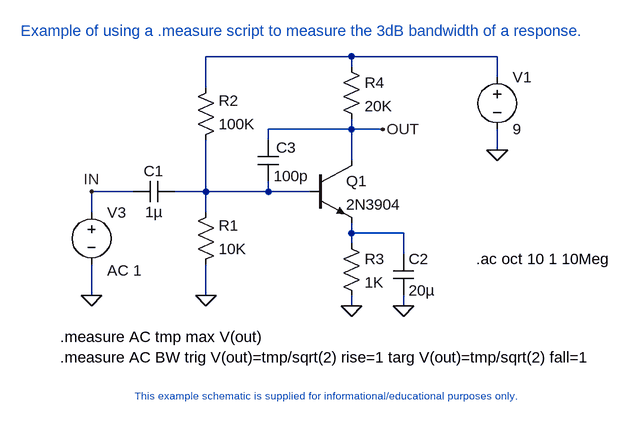
[diagram p0: schematic BW.asc]
BW.asc, the LTspice schematic file:
Version 4
SHEET 1 2344 1936
WIRE 400 1152 176 1152
WIRE 624 1152 400 1152
WIRE 400 1168 400 1152
WIRE 624 1184 624 1152
WIRE 176 1200 176 1152
WIRE 400 1264 400 1248
WIRE 400 1264 272 1264
WIRE 448 1264 400 1264
WIRE 272 1280 272 1264
WIRE 624 1296 624 1264
WIRE 400 1312 400 1264
WIRE 64 1360 0 1360
WIRE 176 1360 176 1280
WIRE 176 1360 128 1360
WIRE 272 1360 272 1344
WIRE 272 1360 176 1360
WIRE 336 1360 272 1360
WIRE 0 1392 0 1360
WIRE 176 1392 176 1360
WIRE 400 1424 400 1408
WIRE 480 1424 400 1424
WIRE 400 1440 400 1424
WIRE 480 1456 480 1424
WIRE 0 1520 0 1472
WIRE 176 1520 176 1472
WIRE 400 1536 400 1520
WIRE 480 1536 480 1520
FLAG 0 1520 0
FLAG 0 1360 IN
FLAG 176 1520 0
FLAG 400 1536 0
FLAG 448 1264 OUT
FLAG 624 1296 0
FLAG 480 1536 0
SYMBOL npn 336 1312 R0
SYMATTR InstName Q1
SYMATTR Value 2N3904
SYMBOL res 384 1424 R0
SYMATTR InstName R3
SYMATTR Value 1K
SYMBOL voltage 0 1376 R0
WINDOW 123 24 105 Left 2
SYMATTR Value2 AC 1
SYMATTR InstName V3
SYMATTR Value ""
SYMBOL res 160 1488 M180
WINDOW 0 36 76 Left 2
WINDOW 3 36 40 Left 2
SYMATTR InstName R1
SYMATTR Value 10K
SYMBOL cap 128 1344 R90
WINDOW 0 0 32 VBottom 2
WINDOW 3 32 32 VTop 2
SYMATTR InstName C1
SYMATTR Value 1µ
SYMBOL res 160 1296 M180
WINDOW 0 36 76 Left 2
WINDOW 3 36 40 Left 2
SYMATTR InstName R2
SYMATTR Value 100K
SYMBOL voltage 624 1168 R0
SYMATTR InstName V1
SYMATTR Value 9
SYMBOL cap 464 1456 R0
SYMATTR InstName C2
SYMATTR Value 20µ
SYMBOL res 384 1152 R0
SYMATTR InstName R4
SYMATTR Value 20K
SYMBOL cap 256 1344 M180
WINDOW 0 28 52 Left 2
WINDOW 3 24 8 Left 2
SYMATTR InstName C3
SYMATTR Value 100p
TEXT 592 1464 Left 2 !.ac oct 10 1 10Meg
TEXT 352 1664 Top 1 ;This example schematic is supplied for informational/educational purposes only.
TEXT -48 1584 Left 2 !.measure AC tmp max V(out)\n.measure AC BW trig V(out)=tmp/sqrt(2) rise=1 targ V(out)=tmp/sqrt(2) fall=1
TEXT 328 1128 Bottom 2 ;Example of using a .measure script to measure the 3dB bandwidth of a response.

The netlist it stands for:
* BW.asc
Q1 OUT N002 N003 0 2N3904
R3 N003 0 1K
V3 IN 0 AC 1
R1 0 N002 10K
C1 N002 IN 1µ
R2 N002 N001 100K
V1 N001 0 9
C2 N003 0 20µ
R4 N001 OUT 20K
C3 N002 OUT 100p
.model NPN NPN
.model PNP PNP
.lib standard.bjt
.ac oct 10 1 10Meg
* This example schematic is supplied for informational/educational purposes only.
.measure AC tmp max V(out)
.measure AC BW trig V(out)=tmp/sqrt(2) rise=1 targ V(out)=tmp/sqrt(2) fall=1
* Example of using a .measure script to measure the 3dB bandwidth of a response.
.backanno
.end